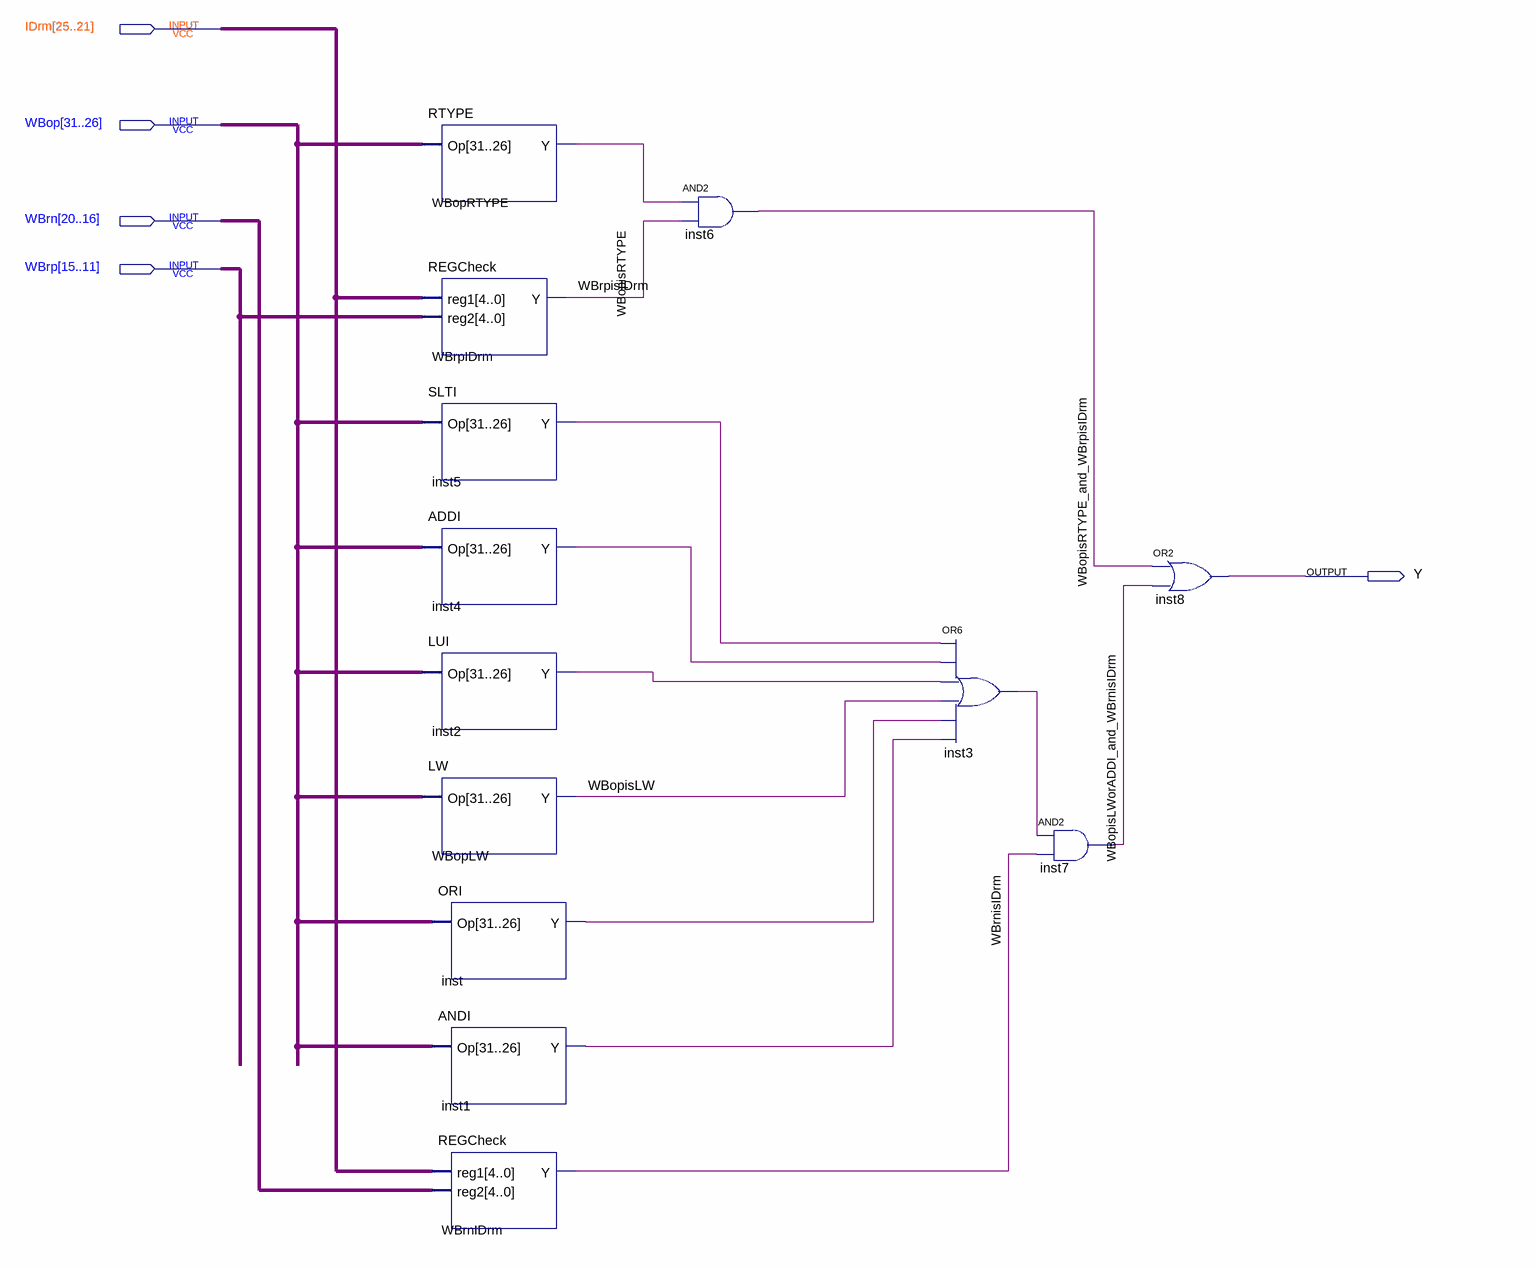
[diagram p0: schematic sheet]
// Quartus schematic ForwardAfromWBtoID.bdf as structural Verilog: 13 symbols, 5 pins
module ForwardAfromWBtoID (
  input  [25:21] IDrm,
  input  [31:26] WBop,
  input  [20:16] WBrn,
  input  [15:11] WBrp,
  output Y
);

  wire inst1_y, inst2_y, inst3_out, inst4_y, inst5_y, inst_y, WBopisLW, WBopisLWorADDI_and_WBrnisIDrm,
       WBopisRTYPE, WBopisRTYPE_and_WBrpisIDrm, WBrnisIDrm, WBrpisIDrm;

  RTYPE WBopRTYPE (.Op(WBop), .Y(WBopisRTYPE));
  REGCheck WBrpIDrm (.reg1(IDrm), .reg2(WBrp), .Y(WBrpisIDrm));
  SLTI inst5 (.Op(WBop), .Y(inst5_y));
  ADDI inst4 (.Op(WBop), .Y(inst4_y));
  LUI inst2 (.Op(WBop), .Y(inst2_y));
  LW WBopLW (.Op(WBop), .Y(WBopisLW));
  ORI inst (.Op(WBop), .Y(inst_y));
  ANDI inst1 (.Op(WBop), .Y(inst1_y));
  REGCheck WBrnIDrm (.reg1(IDrm), .reg2(WBrn), .Y(WBrnisIDrm));
  and inst6 (WBopisRTYPE_and_WBrpisIDrm, WBopisRTYPE, WBrpisIDrm);
  or inst3 (inst3_out, inst5_y, inst4_y, inst2_y, WBopisLW, inst_y, inst1_y);
  and inst7 (WBopisLWorADDI_and_WBrnisIDrm, inst3_out, WBrnisIDrm);
  or inst8 (Y, WBopisRTYPE_and_WBrpisIDrm, WBopisLWorADDI_and_WBrnisIDrm);
endmodule
